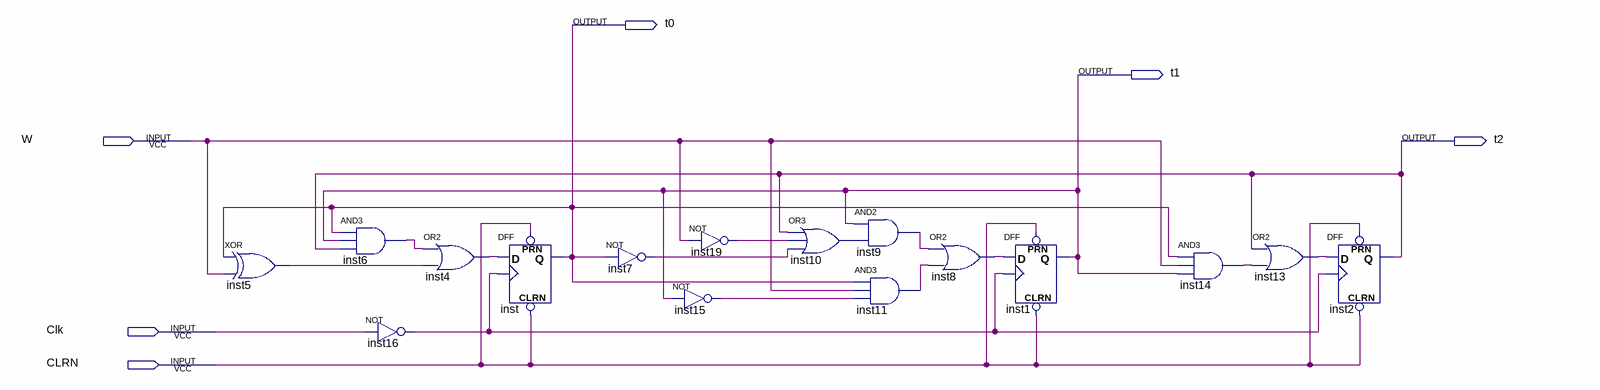
[diagram p0: schematic sheet]
// Quartus schematic FSM_without_comparator.bdf as structural Verilog: 16 symbols, 6 pins
module FSM_without_comparator (
  input  W,
  input  Clk,
  input  CLRN,
  output t0,
  output t1,
  output t2
);

  wire inst4_out, inst5_out, inst6_out, inst7_out, inst8_out, inst9_out, inst10_out, inst11_out, inst13_out,
       inst14_out, inst15_out, inst16_out, inst19_out;

  xor inst5 (inst5_out, t0, W);
  and inst6 (inst6_out, t0, t1, t2);
  not inst16 (inst16_out, Clk);
  or inst4 (inst4_out, inst6_out, inst5_out);
  DFF inst (.CLRN(CLRN), .CLK(inst16_out), .D(inst4_out), .PRN(CLRN), .Q(t0));
  not inst7 (inst7_out, t0);
  not inst19 (inst19_out, W);
  not inst15 (inst15_out, t1);
  or inst10 (inst10_out, t2, inst19_out, inst7_out);
  and inst9 (inst9_out, t1, inst10_out);
  and inst11 (inst11_out, t0, W, inst15_out);
  or inst8 (inst8_out, inst9_out, inst11_out);
  DFF inst1 (.CLRN(CLRN), .CLK(inst16_out), .D(inst8_out), .PRN(CLRN), .Q(t1));
  and inst14 (inst14_out, t0, W, t1);
  or inst13 (inst13_out, t2, inst14_out);
  DFF inst2 (.CLRN(CLRN), .CLK(inst16_out), .D(inst13_out), .PRN(CLRN), .Q(t2));
endmodule
